# EAGLE schematic ESP_AC_IRsch (EAGLE 9.3.1)
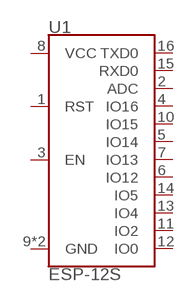
[diagram p0: schematic, sheet 1]

## Parts
U1  ESP-12S  [ESP-12S]
Unconnected: U1.1(RST) U1.2(ADC) U1.3(EN) U1.4(IO16) U1.5(IO14) U1.6(IO12) U1.7(IO13) U1.8(VCC) U1.9(GND) U1.10(IO15) U1.11(IO2) U1.12(IO0) U1.13(IO4) U1.14(IO5) U1.15(RXD0) U1.16(TXD0) U1.P$1(GND)

## Library data of the parts
U1 = SparkFun-RF:ESP-12S: AI-Thinker ESP-12S ESP-12S WiFi module is developed by AI-Thinker Co.,Ltd, core processor ESP8266 in smaller sizes of the module encapsulates Tensilica L106 integrates industry-leading ultra low power 32-bit MCU micro, with the 16-bit short mode, clock speed support 80 MHz, 160 MHz, supports the RTOS, integrated Wi-Fi MAC/BB/RF/PA/LNA, on-board antennas.; PROD_ID: IC-14115